# EAGLE design IMU and TTL Shield (EAGLE 9.6.2)
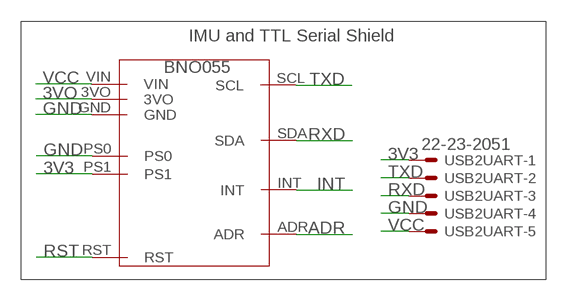
[diagram p0: schematic, sheet 1]

## Parts
U$1  BNO055  [MODULE_FOOTPRINT]
USB2UART  22-23-2051  [22-23-2051]

## Nets
3V3: U$1.PS1 USB2UART.1
3VO: U$1.3VO
ADR: U$1.ADR
GND: U$1.GND U$1.PS0 USB2UART.4
INT: U$1.INT
RST: U$1.RST
RXD: U$1.SDA USB2UART.3
TXD: U$1.SCL USB2UART.2
VCC: U$1.VIN USB2UART.5

## Notes on the sheet
- IMU and TTL Serial Shield

## Library data of the parts
U$1 = BNO055 IMU:BNO055
USB2UART = con-molex:22-23-2051: .100" (2.54mm) Center Header - 5 Pin; MF: MOLEX; MPN: 22-23-2051; OC_FARNELL: 1462952; OC_NEWARK: 38C9178

## Board
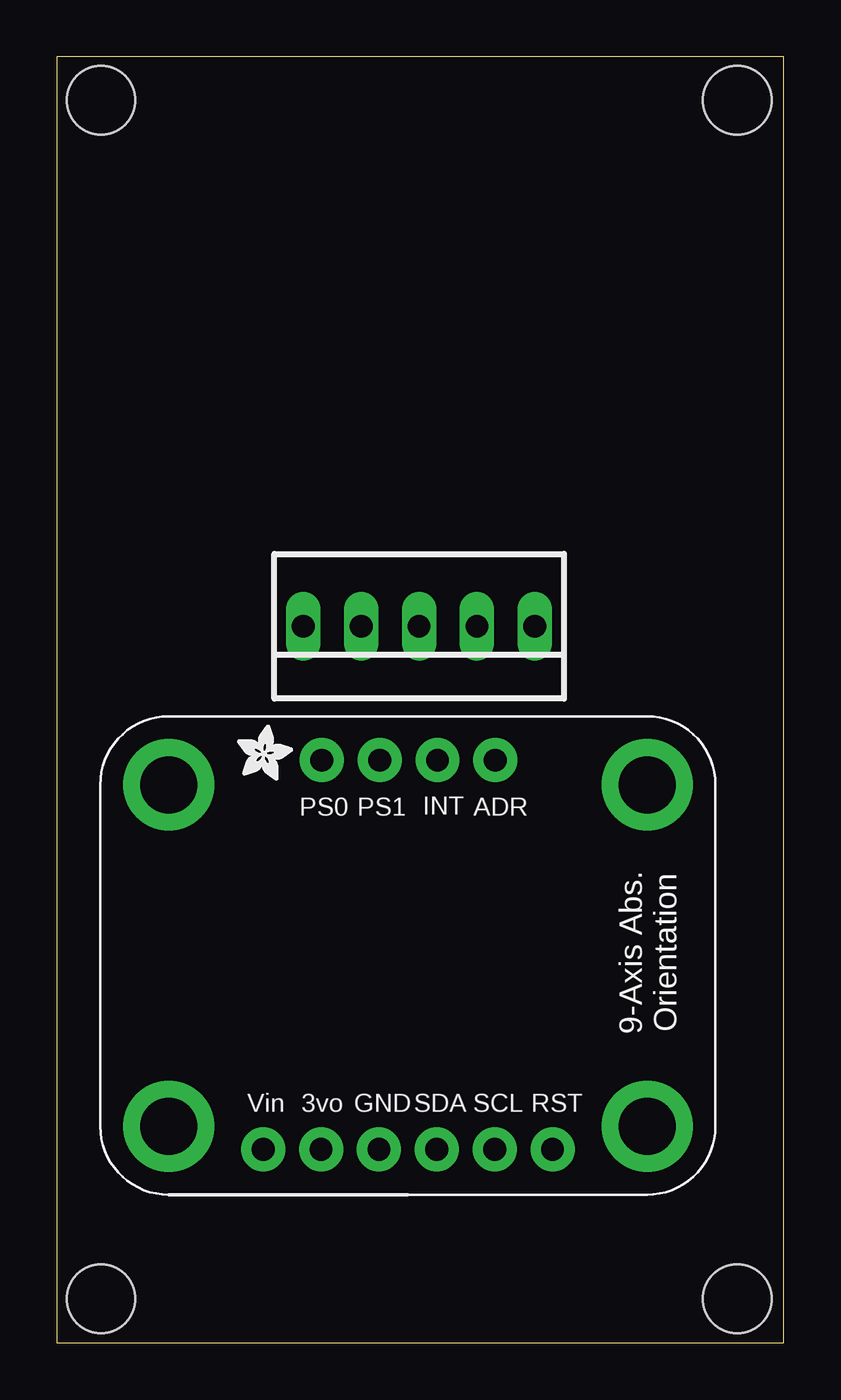
[diagram p1: board, top side]
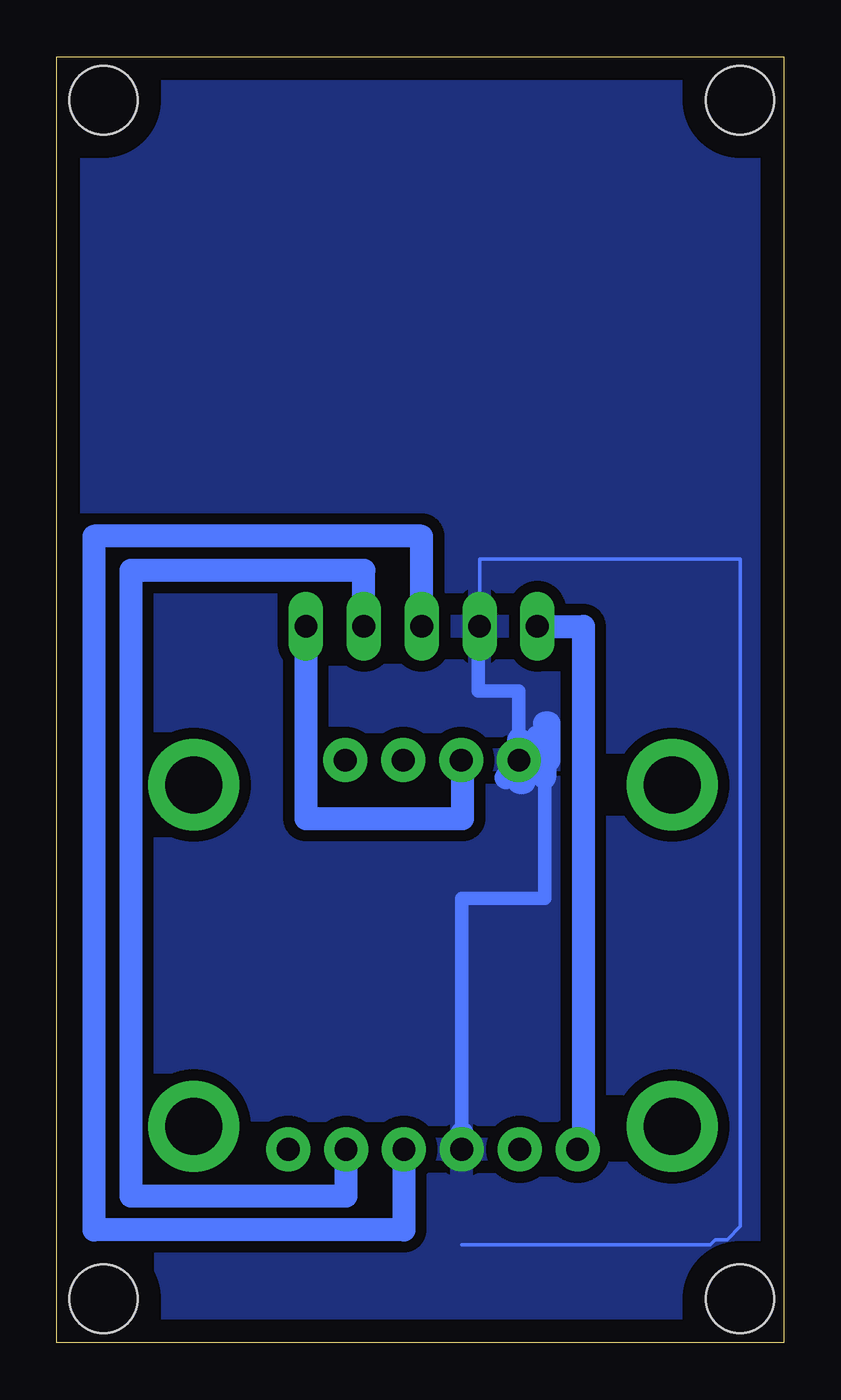
[diagram p2: board, bottom side, seen from below]

Size 31.9 x 56.45 mm. Coordinates in mm from the lower left corner, seen from the top.
Outline: 0,0 31.9,0 31.9,56.45 0,56.45 0,0
Copper layers (1*16): Top 0.035mm / dielectric 1.5mm / Bottom 0.035mm
Design rules "default *": minimum track width 6mil, minimum drill 0.35mm, track to track 0.5mm, track to pad 6mil, pad to pad 6mil, via to via 6mil, smd to smd 6mil, copper to edge 40mil, drill to drill 6mil, minimum pad ring 10mil, minimum via ring 8mil, stop-mask expansion 4mil, vias tented up to drill 0mil, thermal gap 10mil
Holes 3 mm at 29.86,54.54 1.93,54.54 29.86,1.92 1.93,1.92

### Footprints (pad centres in the part's own frame; a part is rotated, then mirrored left to right if it is on the bottom)
MODULE_FOOTPRINT = drill 1 pad 1.93: 3VO 6.69,1.991; ADR 14.342,19.077; GND 9.23,1.991; INT 11.802,19.077; PS0 6.722,19.077; PS1 9.262,19.077; RST 16.85,1.991; SCL 14.31,1.991; SDA 11.77,1.991; VIN 4.15,1.991 | drill 2.5 pad 4: P$1 21,3; P$2 0,3; P$3 0,18; P$4 21,18
22-23-2051 = drill 1 long: 1 -5.08,0; 2 -2.54,0; 3 0,0; 4 2.54,0; 5 5.08,0

### Placement (x,y rotation side)
U$1  4.9,6.49 0 top
USB2UART  15.89,31.45 180 top

### Tracks (layer width: path | path; a pad name or v marks a point on that pad's centre or on a via)
3V3
  Bottom 1: U$1.PS1 14.1,25.57 14.1,23 20.97,23 USB2UART.1
GND
  Bottom 0.152: 13.2,31.6 USB2UART.4 13.35,34.4 1.9,34.4 1.9,5.1 2.48,4.52 3,4.52 3.22,4.3 14.13,4.3
  Bottom 0.6: U$1.GND 14.13,19.5 10.5,19.5 10.5,24.8 | 11.62,26.5 11.62,28.6 13.4,28.6 13.4,31.6 13.2,31.6
  Bottom 1: U$1.GND 14.13,9.2 | U$1.PS0 11.62,26.5 | U$1.PS0 10.8,25.57 10.8,26.6 10.5,26.6 | U$1.PS0 11.62,24.6 11.4,24.6 11.4,24.8 12.2,24.8 | U$1.PS0 10.3,25.57 10.3,27.2 10.5,27.2 10.5,24.8
  pour Bottom: -2.3,57.6 33.4,57.6 33.4,-1.5 -2.3,-1.5
RXD
  Bottom 1: USB2UART.3 15.89,35.4 30.28,35.4 30.28,4.94 16.67,4.94 16.67,7.28 U$1.SDA
TXD
  Bottom 1: USB2UART.2 18.43,33.9 28.65,33.9 28.65,6.44 19.21,6.44 U$1.SCL
VCC
  Bottom 1: USB2UART.5 8.8,31.45 8.8,8.73 U$1.VIN

### Text on the board
Document: VCC | GND | RXD | TXD | 3V3